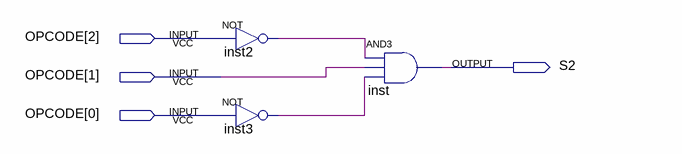
[diagram p0: schematic sheet]
// Quartus schematic DecoRESTA.bdf as structural Verilog: 3 symbols, 4 pins
module DecoRESTA (
  input  [2:0] OPCODE,
  output S2
);

  wire inst2_out, inst3_out;

  not inst2 (inst2_out, OPCODE[2]);
  not inst3 (inst3_out, OPCODE[0]);
  and inst (S2, inst2_out, OPCODE[1], inst3_out);
endmodule
